# EAGLE design board (EAGLE 9.6.2)
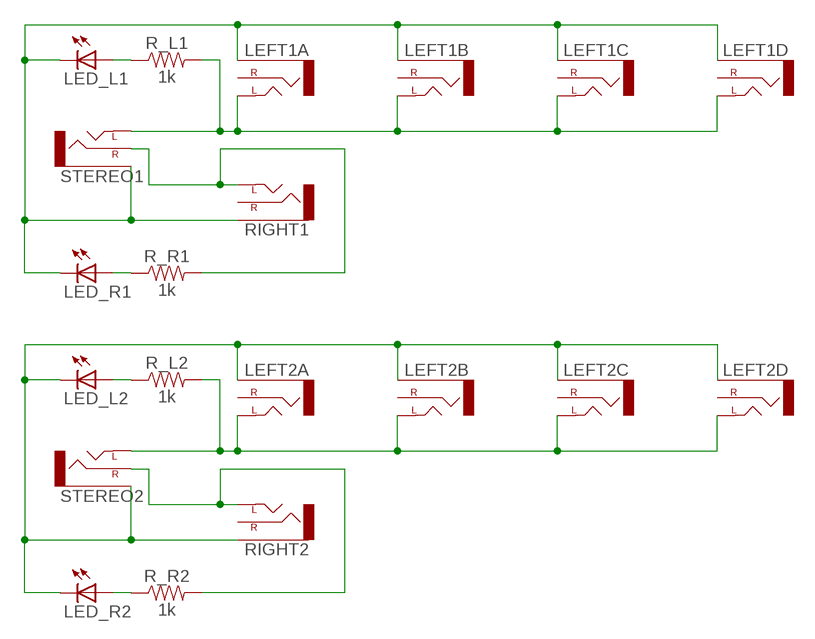
[diagram p0: schematic, sheet 1]

## Parts
LED_L1  LED3MM  [LED3MM]
LED_L2  LED3MM  [LED3MM]
LED_R1  LED3MM  [LED3MM]
LED_R2  LED3MM  [LED3MM]
LEFT1A  THONKI-STEREO  [WQP-PJ366ST_JACK]
LEFT1B  THONKI-STEREO  [WQP-PJ366ST_JACK]
LEFT1C  THONKI-STEREO  [WQP-PJ366ST_JACK]
LEFT1D  THONKI-STEREO  [WQP-PJ366ST_JACK]
LEFT2A  THONKI-STEREO  [WQP-PJ366ST_JACK]
LEFT2B  THONKI-STEREO  [WQP-PJ366ST_JACK]
LEFT2C  THONKI-STEREO  [WQP-PJ366ST_JACK]
LEFT2D  THONKI-STEREO  [WQP-PJ366ST_JACK]
R_L1  1k  1KOHM-HORIZ-1/4W-1%  [AXIAL-0.3]
R_L2  1k  1KOHM-HORIZ-1/4W-1%  [AXIAL-0.3]
R_R1  1k  1KOHM-HORIZ-1/4W-1%  [AXIAL-0.3]
R_R2  1k  1KOHM-HORIZ-1/4W-1%  [AXIAL-0.3]
RIGHT1  THONKI-STEREO  [WQP-PJ366ST_JACK]
RIGHT2  THONKI-STEREO  [WQP-PJ366ST_JACK]
STEREO1  THONKI-STEREO  [WQP-PJ366ST_JACK]
STEREO2  THONKI-STEREO  [WQP-PJ366ST_JACK]

## Nets
N$1: LEFT1A.P$1_TIP(LEFT) LEFT1B.P$1_TIP(LEFT) LEFT1C.P$1_TIP(LEFT) LEFT1D.P$1_TIP(LEFT) R_L1.P$2 STEREO1.P$1_TIP(LEFT)
N$2: R_R1.P$2 RIGHT1.P$1_TIP(LEFT) STEREO1.P$2_SWITCH(RIGHT)
N$3: LED_L1.K(C) LED_R1.K(C) LEFT1A.P$3_SLEEVE(SLEEVE) LEFT1B.P$3_SLEEVE(SLEEVE) LEFT1C.P$3_SLEEVE(SLEEVE) LEFT1D.P$3_SLEEVE(SLEEVE) RIGHT1.P$3_SLEEVE(SLEEVE) STEREO1.P$3_SLEEVE(SLEEVE)
N$4: LED_L1.A R_L1.P$1
N$5: LED_R1.A R_R1.P$1
N$6: LEFT2A.P$1_TIP(LEFT) LEFT2B.P$1_TIP(LEFT) LEFT2C.P$1_TIP(LEFT) LEFT2D.P$1_TIP(LEFT) R_L2.P$2 STEREO2.P$1_TIP(LEFT)
N$7: LED_L2.K(C) LED_R2.K(C) LEFT2A.P$3_SLEEVE(SLEEVE) LEFT2B.P$3_SLEEVE(SLEEVE) LEFT2C.P$3_SLEEVE(SLEEVE) LEFT2D.P$3_SLEEVE(SLEEVE) RIGHT2.P$3_SLEEVE(SLEEVE) STEREO2.P$3_SLEEVE(SLEEVE)
N$8: R_R2.P$2 RIGHT2.P$1_TIP(LEFT) STEREO2.P$2_SWITCH(RIGHT)
N$9: LED_L2.A R_L2.P$1
N$10: LED_R2.A R_R2.P$1
Unconnected: LEFT1A.P$2_SWITCH(RIGHT) LEFT1B.P$2_SWITCH(RIGHT) LEFT1C.P$2_SWITCH(RIGHT) LEFT1D.P$2_SWITCH(RIGHT) LEFT2A.P$2_SWITCH(RIGHT) LEFT2B.P$2_SWITCH(RIGHT) LEFT2C.P$2_SWITCH(RIGHT) LEFT2D.P$2_SWITCH(RIGHT) RIGHT1.P$2_SWITCH(RIGHT) RIGHT2.P$2_SWITCH(RIGHT)

## Library data of the parts
LED_L1 LED_L2 LED_R1 LED_R2 = adafruit:LED: LED OSRAM: - CHIPLED LG R971, LG N971, LY N971, LG Q971, LY Q971, LO R971, LY R971 LH N974, LH R974 LS Q976, LO Q976, LY Q976 LO Q996 - Hyper CHIPLED LW Q18S LB Q993, LB Q99A, LB R99A - SideLED LS A670, LO A670, LY A670, LG A670, LP A670 LB A673, LV A673, LT A673, LW A673 LH A674 LY A675 LS A676, LA A676, LO A676, LY A676, LW A676 LS A679, LY A679, LG A679 - Hyper Micro SIDELED® LS Y876, LA Y876, LO Y876, LY Y876 LT Y87S - SmartLED LW L88C, LW L88S LB L89C, LB L89S, LG L890 LS L89K, LO L89K, LY L89K LS L896, LA L896, LO L896, LY L896 - TOPLED LS T670, LO T670, LY T670, LG T670, LP T670 LSG T670, LSP T670, LSY T670, LOP T670, LYG T670 LG T671, LOG T671, LSG T671 LB T673, LV T673, LT T673, LW T673 LH T674 LS T676, LA T676, LO T676, LY T676, LB T676, LH T676, LSB T676, LW T676 LB T67C, LV T67C, LT T67C, LS T67K, LO T67K, LY T67K, LW E67C LS E67B, LA E67B, LO E67B, LY E67B, LB E67C, LV E67C, LT E67C LW T67C LS T679, LY T679, LG T679 LS T770, LO T770, LY T770, LG T770, LP T770 LB T773, LV T773, LT T773, LW T773 LH T774 LS E675, LA E675, LY E675, LS T675 LS T776, LA T776, LO T776, LY T776, LB T776 LHGB T686 LT T68C, LB T68C - Hyper Mini TOPLED® LB M676 - Mini TOPLED Santana® LG M470 LS M47K, LO M47K, LY M47K Source: http://www.osram.convergy.de/
LEFT1A LEFT1B LEFT1C LEFT1D LEFT2A LEFT2B LEFT2C LEFT2D RIGHT1 RIGHT2 STEREO1 STEREO2 = MusicThingModular:THONKI-STEREO: 3.5mm socket for Eurorack modular synths
R_L1 R_L2 R_R1 R_R2 = SparkFun-Resistors:1KOHM: 1kΩ resistor A resistor is a passive two-terminal electrical component that implements electrical resistance as a circuit element. Resistors act to reduce current flow, and, at the same time, act to lower voltage levels within circuits. - Wikipedia; PROD_ID: RES-12182

## Board
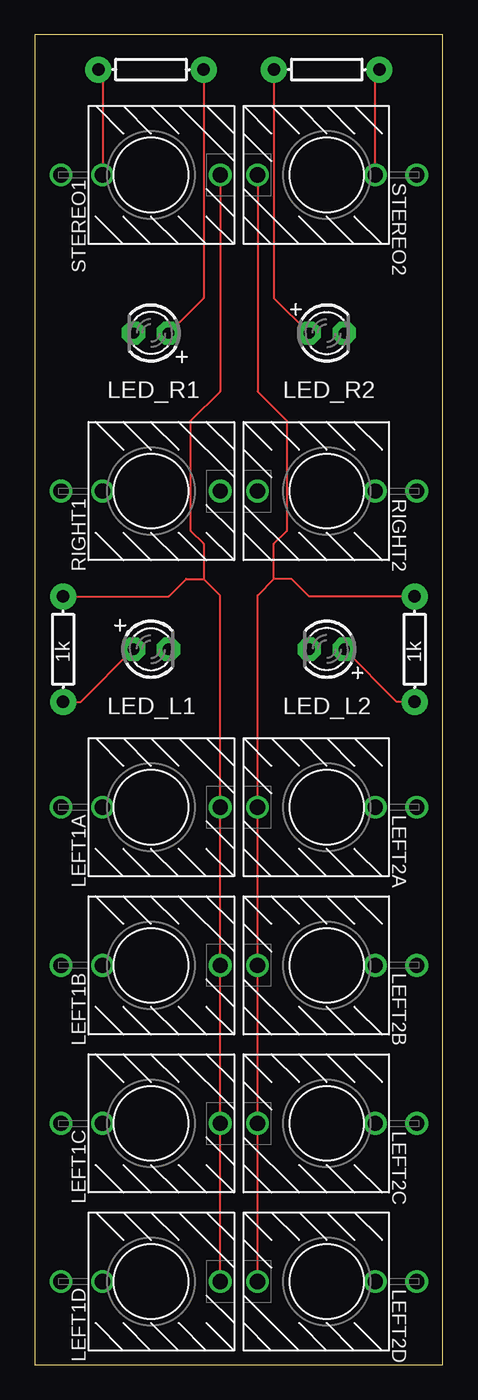
[diagram p1: board, top side]
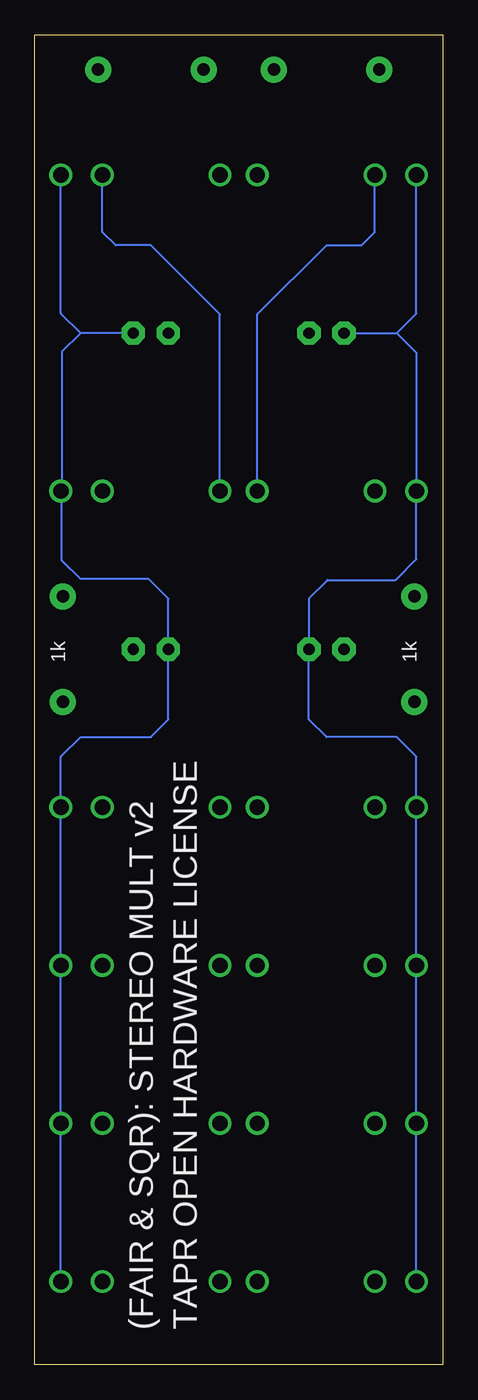
[diagram p2: board, bottom side, seen from below]

Size 29.52 x 96.19 mm. Coordinates in mm from the lower left corner, seen from the top.
Outline: 0,0 29.52,0 29.52,96.19 0,96.19 0,0
Copper layers (1*16): Top 0.035mm / dielectric 1.5mm / Bottom 0.035mm
Design rules "default": minimum track width 6mil, minimum drill 0.35mm, track to track 6mil, track to pad 6mil, pad to pad 6mil, via to via 6mil, smd to smd 6mil, copper to edge 40mil, drill to drill 6mil, minimum pad ring 10mil, minimum via ring 8mil, stop-mask expansion 4mil, vias tented up to drill 0mil, thermal gap 10mil

### Footprints (pad centres in the part's own frame; a part is rotated, then mirrored left to right if it is on the bottom)
LED3MM = drill 0.813 pad 1.676 octagon: A -1.27,0; K 1.27,0
WQP-PJ366ST_JACK = drill 1.1: P$1_TIP 0,5; P$2_SWITCH 0,-3.5; P$3_SLEEVE 0,-6.5
AXIAL-0.3 = drill 0.9 pad 1.88: P$1 -3.81,0; P$2 3.81,0

### Placement (x,y rotation side)
LED_L1  8.41,51.75 0 top
LED_L2  21.11,51.75 180 top
LED_R1  8.41,74.61 180 top
LED_R2  21.11,74.61 0 top
LEFT1A  8.41,40.32 270 top
LEFT1B  8.41,28.89 270 top
LEFT1C  8.41,17.46 270 top
LEFT1D  8.41,6.03 270 top
LEFT2A  21.11,40.32 90 top
LEFT2B  21.11,28.89 90 top
LEFT2C  21.11,17.46 90 top
LEFT2D  21.11,6.03 90 top
R_L1  2.06,51.75 90 top
R_L2  27.46,51.75 90 top
R_R1  8.41,93.66 180 top
R_R2  21.11,93.66 0 top
RIGHT1  8.41,63.18 270 top
RIGHT2  21.11,63.18 90 top
STEREO1  8.41,86.04 270 top
STEREO2  21.11,86.04 90 top

### Tracks (layer width: path | path; a pad name or v marks a point on that pad's centre or on a via)
N$1
  Top 0.152: LEFT1D.P$1_TIP LEFT1C.P$1_TIP LEFT1B.P$1_TIP LEFT1A.P$1_TIP 13.41,55.64 12.22,56.83 | R_L1.P$2 9.68,55.56 10.95,56.83 12.22,56.83 | 12.22,56.83 12.22,59.37 11.29,60.31 11.29,68.26 13.41,70.39 STEREO1.P$1_TIP
N$2
  Top 0.152: R_R1.P$2 4.91,93.35 STEREO1.P$2_SWITCH
  Bottom 0.152: RIGHT1.P$1_TIP 13.41,75.96 8.41,80.96 5.87,80.96 4.91,81.92 STEREO1.P$2_SWITCH
N$3
  Bottom 0.152: LEFT1D.P$3_SLEEVE LEFT1C.P$3_SLEEVE LEFT1B.P$3_SLEEVE LEFT1A.P$3_SLEEVE 1.91,43.98 3.33,45.4 8.41,45.4 9.68,46.67 LED_L1.K 9.68,55.41 8.34,56.76 3.41,56.76 1.91,58.25 RIGHT1.P$3_SLEEVE 1.91,73.19 3.33,74.61 | 3.33,74.61 1.91,76.03 STEREO1.P$3_SLEEVE | LED_R1.K 3.33,74.61
N$4
  Top 0.152: R_L1.P$1 3.33,47.94 LED_L1.A
N$5
  Top 0.152: R_R1.P$1 12.22,77.15 LED_R1.A
N$6
  Top 0.152: LEFT2D.P$1_TIP LEFT2C.P$1_TIP LEFT2B.P$1_TIP LEFT2A.P$1_TIP 16.11,55.64 17.3,56.83 | R_L2.P$2 19.84,55.56 18.57,56.83 17.3,56.83 | 17.3,56.83 17.3,59.37 18.24,60.31 18.24,68.26 16.11,70.39 STEREO2.P$1_TIP
N$7
  Bottom 0.152: LEFT2D.P$3_SLEEVE LEFT2C.P$3_SLEEVE LEFT2B.P$3_SLEEVE LEFT2A.P$3_SLEEVE 27.61,43.98 26.19,45.4 21.11,45.4 19.84,46.67 LED_L2.K 19.84,55.41 21.26,56.83 26.19,56.83 27.54,58.18 27.54,63.11 RIGHT2.P$3_SLEEVE 27.54,63.26 27.54,73.27 26.19,74.61 | 26.19,74.61 27.61,76.03 STEREO2.P$3_SLEEVE | LED_R2.K 26.19,74.61
N$8
  Top 0.152: STEREO2.P$2_SWITCH 24.61,93.35 R_R2.P$2
  Bottom 0.152: RIGHT2.P$1_TIP 16.11,75.96 21.11,80.96 23.65,80.96 24.61,81.92 STEREO2.P$2_SWITCH
N$9
  Top 0.152: R_L2.P$1 26.19,47.94 LED_L2.A
N$10
  Top 0.152: R_R2.P$1 17.3,77.15 LED_R2.A

### Text on the board
tPlace: 1k | 1k
bPlace: 1k | 1k | TAPR OPEN HARDWARE LICENSE | (FAIR & SQR): STEREO MULT v2